# EasyEDA Pro project CapPiano.eprj

# Schematic Piano
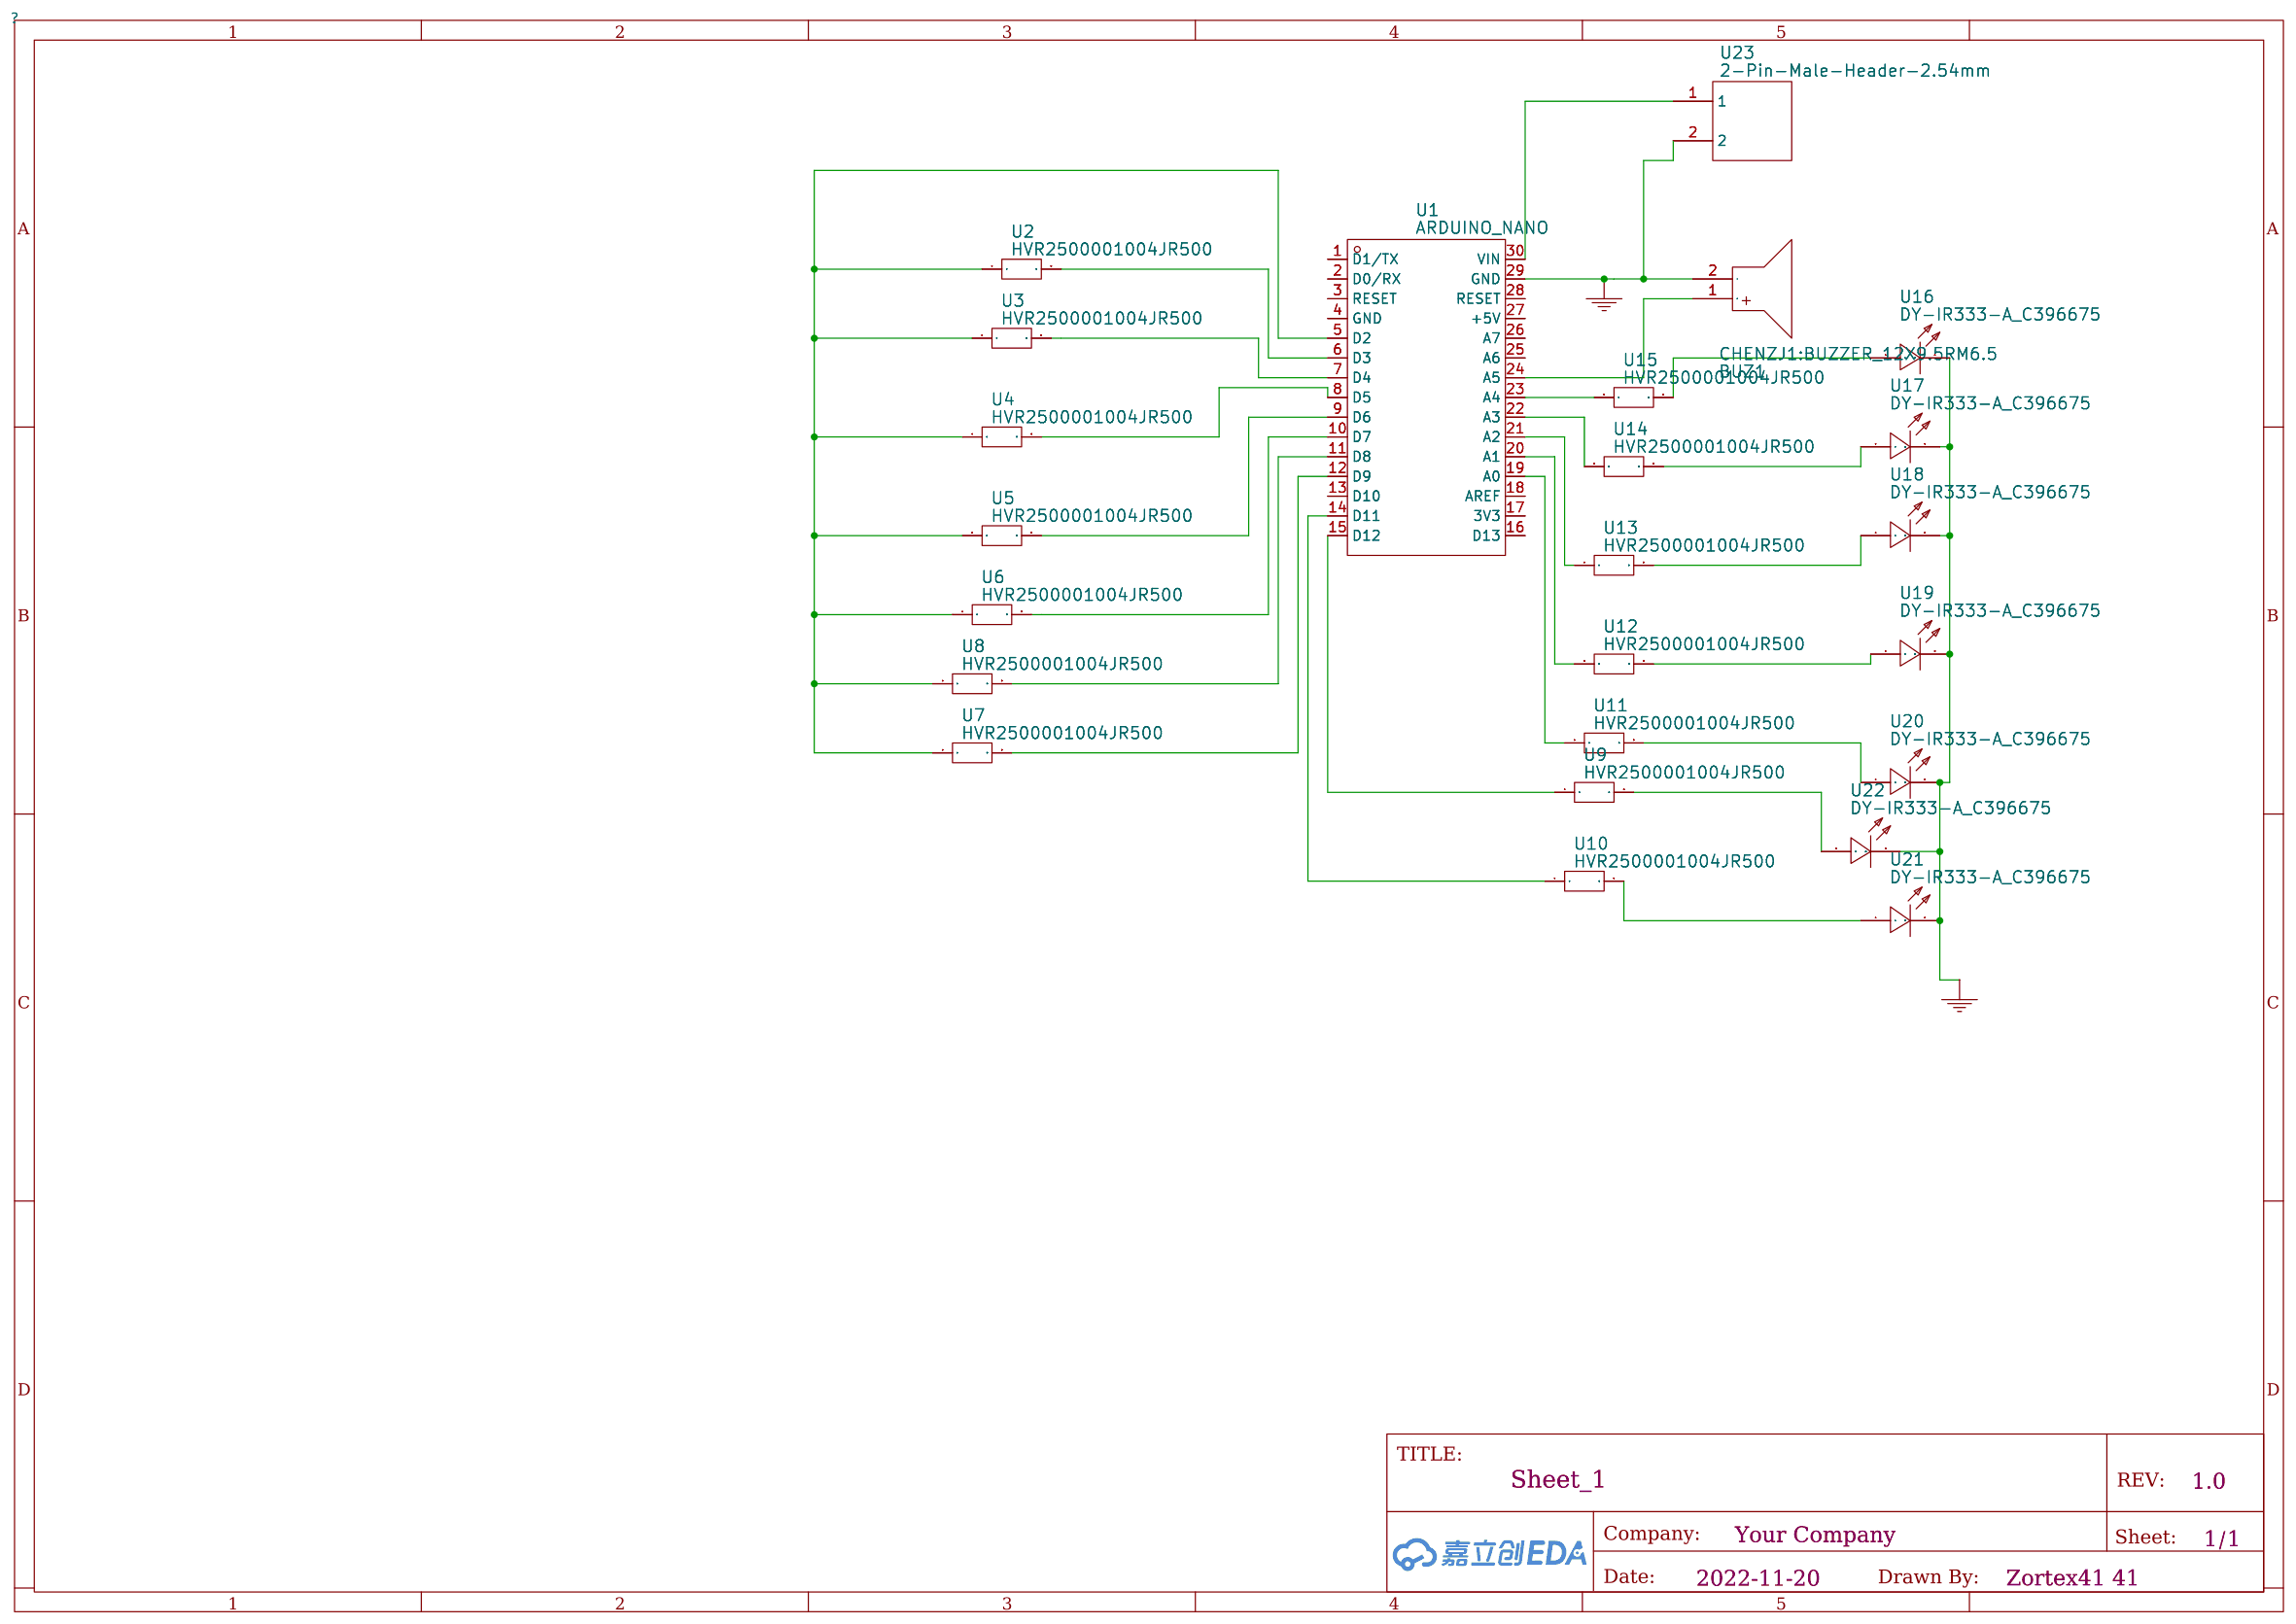
[diagram p0: schematic sheet]

## Parts
BUZ1  CHENZJ1:BUZZER_12X9.5RM6.5  [BUZ-TH_BD12.0-P6.50-D0.6_SEA-1285F]
U1  ARDUINO_NANO  [COMM-TH_ARDUINO_NANO]
U2  HVR2500001004JR500  [RES-TH_BD2.5-L7.0-P11.00-D0.6]
U3  HVR2500001004JR500  [RES-TH_BD2.5-L7.0-P11.00-D0.6]
U4  HVR2500001004JR500  [RES-TH_BD2.5-L7.0-P11.00-D0.6]
U5  HVR2500001004JR500  [RES-TH_BD2.5-L7.0-P11.00-D0.6]
U6  HVR2500001004JR500  [RES-TH_BD2.5-L7.0-P11.00-D0.6]
U7  HVR2500001004JR500  [RES-TH_BD2.5-L7.0-P11.00-D0.6]
U8  HVR2500001004JR500  [RES-TH_BD2.5-L7.0-P11.00-D0.6]
U9  HVR2500001004JR500  [RES-TH_BD2.5-L7.0-P11.00-D0.6]
U10  HVR2500001004JR500  [RES-TH_BD2.5-L7.0-P11.00-D0.6]
U11  HVR2500001004JR500  [RES-TH_BD2.5-L7.0-P11.00-D0.6]
U12  HVR2500001004JR500  [RES-TH_BD2.5-L7.0-P11.00-D0.6]
U13  HVR2500001004JR500  [RES-TH_BD2.5-L7.0-P11.00-D0.6]
U14  HVR2500001004JR500  [RES-TH_BD2.5-L7.0-P11.00-D0.6]
U15  HVR2500001004JR500  [RES-TH_BD2.5-L7.0-P11.00-D0.6]
U16  DY-IR333-A_C396675  [LED-TH_BD5.9-P2.54-FD]
U17  DY-IR333-A_C396675  [LED-TH_BD5.9-P2.54-FD]
U18  DY-IR333-A_C396675  [LED-TH_BD5.9-P2.54-FD]
U19  DY-IR333-A_C396675  [LED-TH_BD5.9-P2.54-FD]
U20  DY-IR333-A_C396675  [LED-TH_BD5.9-P2.54-FD]
U21  DY-IR333-A_C396675  [LED-TH_BD5.9-P2.54-FD]
U22  DY-IR333-A_C396675  [LED-TH_BD5.9-P2.54-FD]
U23  2-Pin-Male-Header-2.54mm  [2-PIN-MALE-HEADER-2.54MM]

## Library data of the parts
BUZ1 = CHENZJ1:BUZZER_12X9.5RM6.5: link: https://atta.szlcsc.com/upload/public/pdf/source/20211008/4CBF24C00656D781101954279FAE3DDF.pdf; Supplier: LCSC; Supplier Part: C9900008742; Manufacturer: null; Manufacturer Part: chenzj1:Buzzer_12x9.5RM6.5; JLCPCB Part Class: Extended Part
U1 = ARDUINO_NANO: link: https://cn.bing.com/search?q=datasheet%3A+%20ARDUINO_NANO; Supplier: LCSC; Supplier Part: C9900017879; Manufacturer: null; JLCPCB Part Class: Extended Part
U2-U15 = HVR2500001004JR500: link: https://atta.szlcsc.com/upload/public/pdf/source/20220512/3BF68C151D5667A1E9CA35E4E9B658B0.pdf; Supplier: LCSC; Supplier Part: C1741713; Manufacturer: VISHAY(威世)
U16-U22 = DY-IR333-A_C396675: link: https://item.szlcsc.com/378450.html; 3DModel: LED-TH_5mm_W; Supplier: LCSC; Supplier Part: C396675; Manufacturer: TONYU; Manufacturer Part: DY-IR333-A; JLCPCB Part Class: Extended Part
U23 = 2-Pin-Male-Header-2.54mm

## Nets
GND: BUZ1.2(-) U1.29(GND) U16.2(C) U17.2(C) U18.2(C) U19.2(C) U20.2(C) U21.2(C) U22.2(C) U23.2
U1_5: U1.5(D2) U2.1 U3.1 U4.1 U5.1 U6.1 U7.1 U8.1
U1_6: U1.6(D3) U2.2
U1_7: U1.7(D4) U3.2
U1_8: U1.8(D5) U4.2
U1_9: U1.9(D6) U5.2
U1_10: U1.10(D7) U6.2
U1_11: U1.11(D8) U8.2
U1_12: U1.12(D9) U7.2
U1_14: U1.14(D11) U10.1
U1_15: U1.15(D12) U9.1
U1_19: U1.19(A0) U11.1
U1_20: U1.20(A1) U12.1
U1_21: U1.21(A2) U13.1
U1_22: U1.22(A3) U14.1
U1_23: U1.23(A4) U15.1
U1_24: BUZ1.1(+) U1.24(A5)
U1_30: U1.30(VIN) U23.1
U9_2: U9.2 U22.1(A)
U10_2: U10.2 U21.1(A)
U11_2: U11.2 U20.1(A)
U12_2: U12.2 U19.1(A)
U13_2: U13.2 U18.1(A)
U14_2: U14.2 U17.1(A)
U15_2: U15.2 U16.1(A)

Not connected (* = marked no-connect by the designer): U1 1(D1/TX) 2(D0/RX) 3(RESET) 4(GND) 13(D10) 16(D13) 17(3V3) 18(AREF) 25(A6) 26(A7) 27(+5V) 28(RESET)

# Board 1-PCB_PCB_Piano
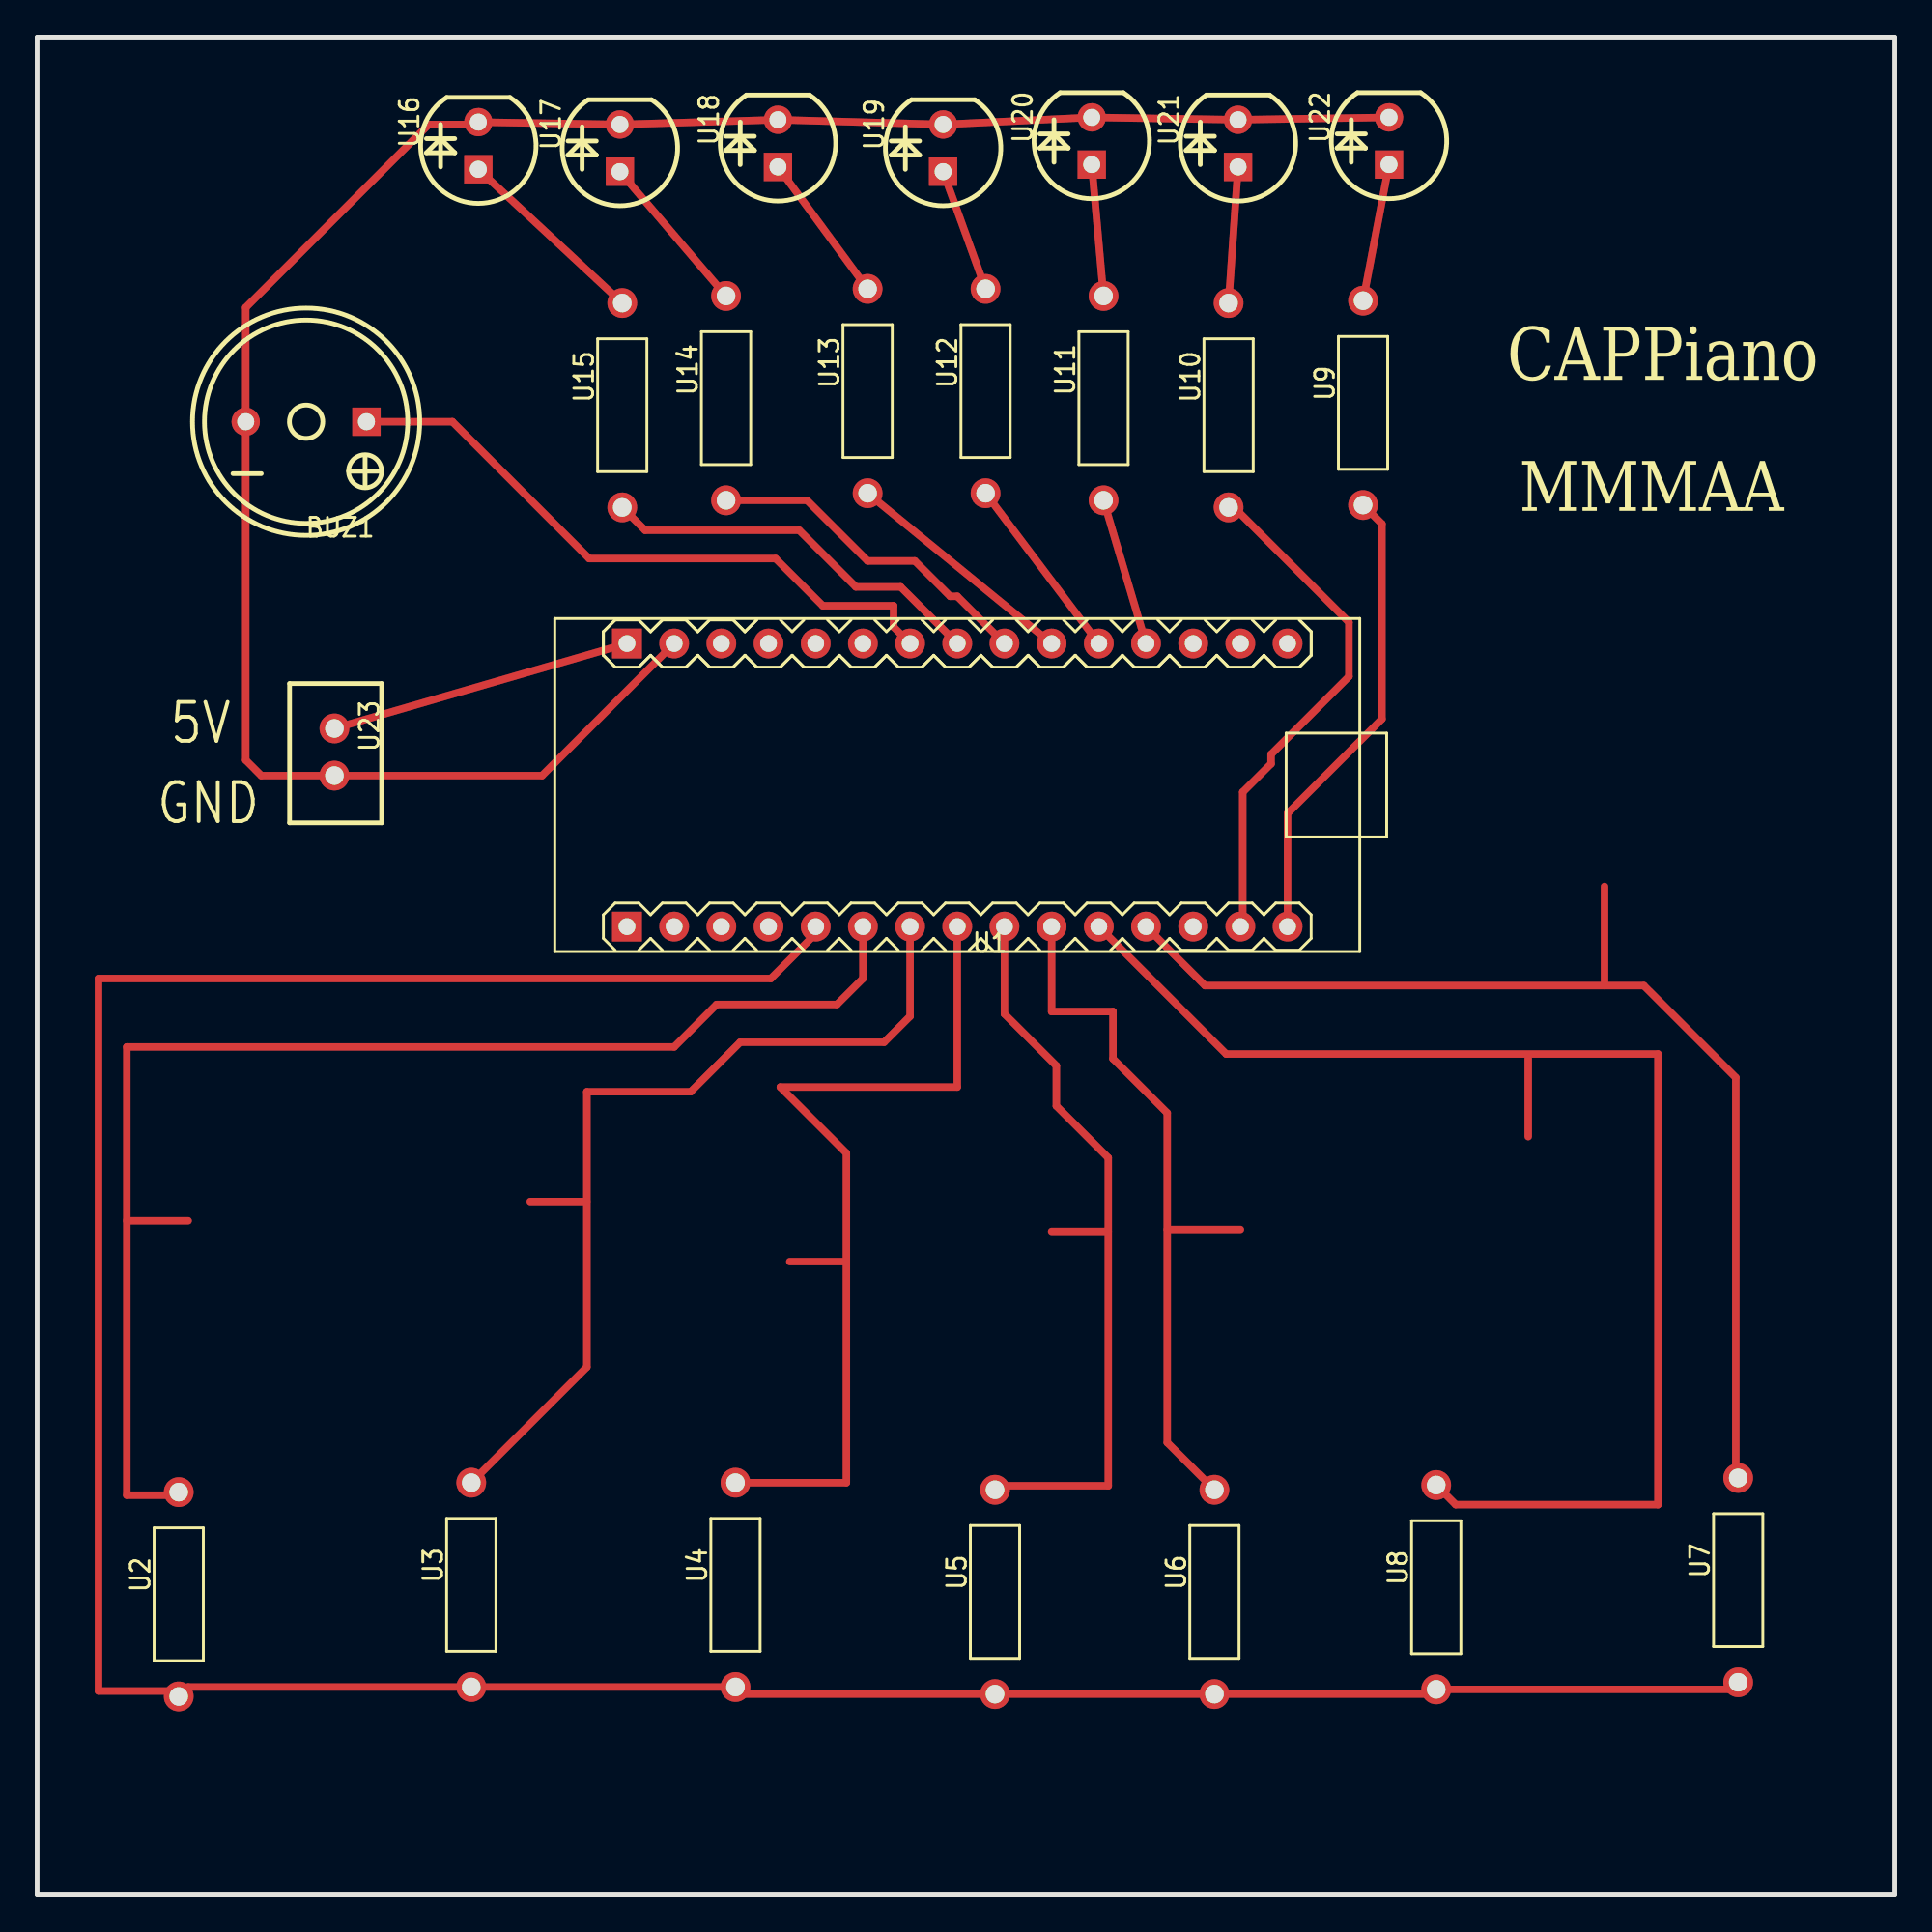
[diagram p1: board, top side]
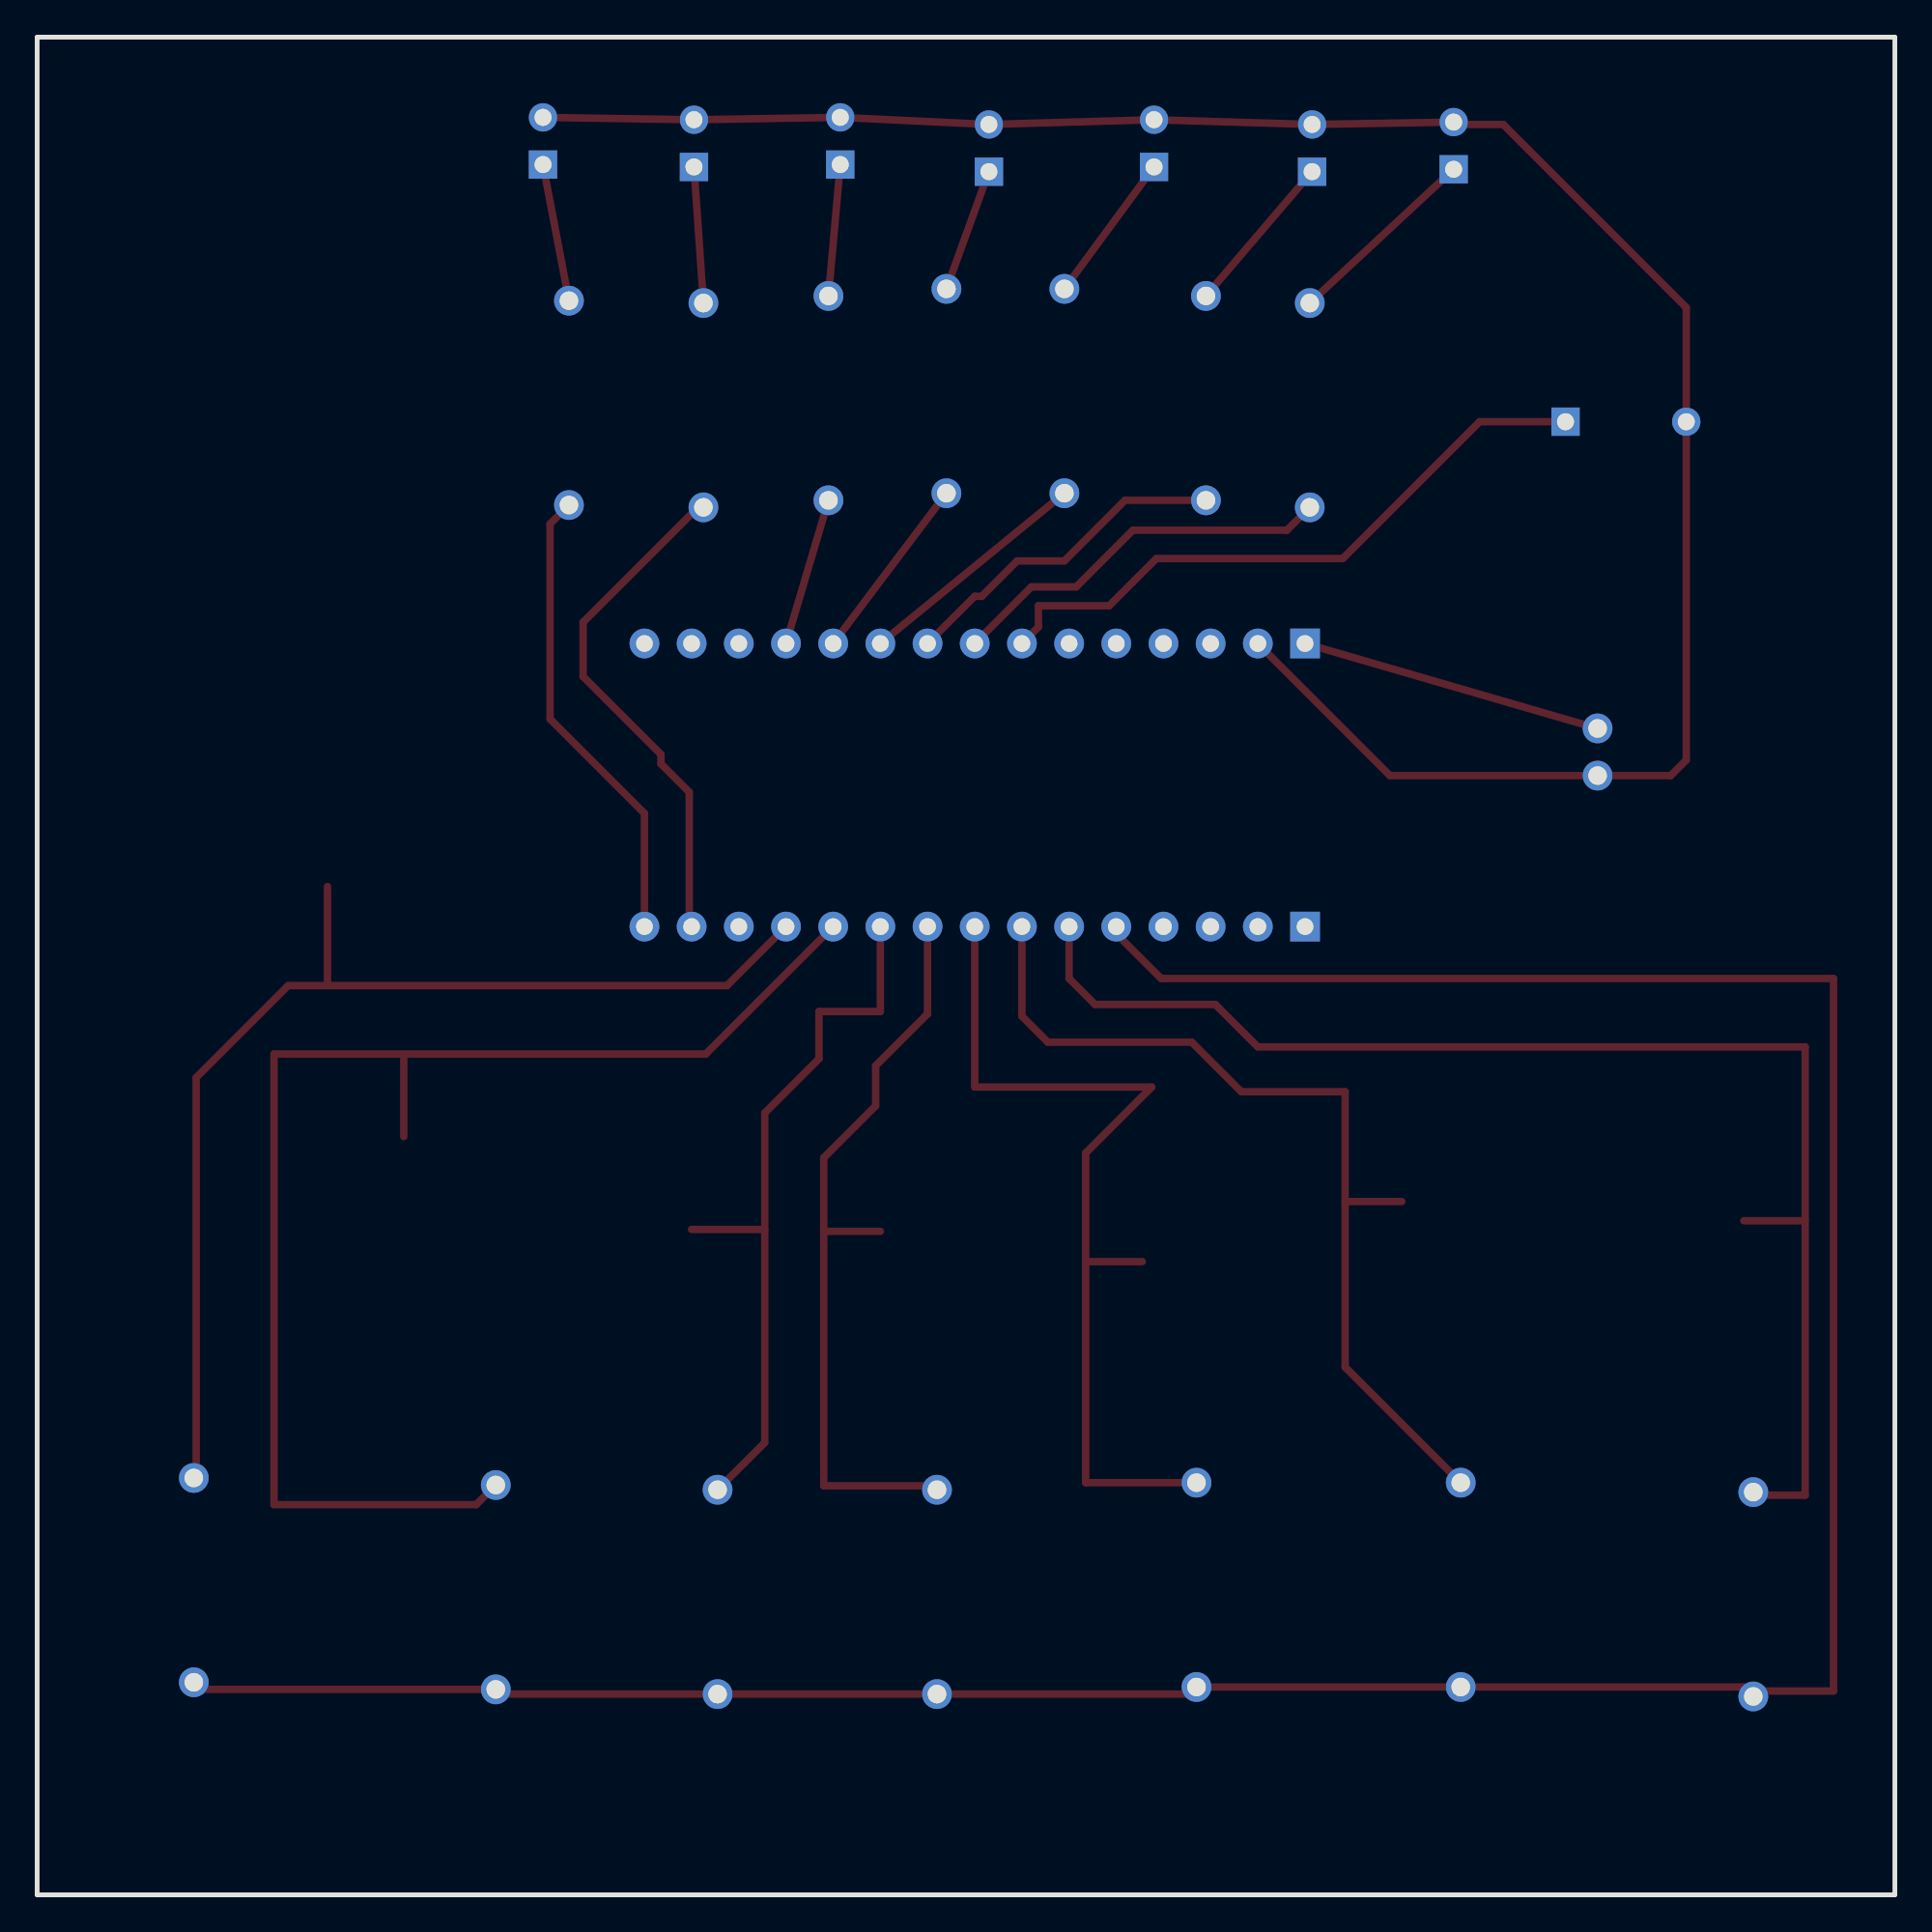
[diagram p2: board, bottom side, seen from below]

Outline 100 x 100 mm; copper layers: Top Layer, Bottom Layer. Coordinates in mm from the lower left corner of the outline.
Outline path: 0,100 100,100 100,0 0,0 0,100
Stack: Top Layer 0.035mm / Dielectric1 1.51mm FR4 er 4.5 / Bottom Layer 0.035mm

## Design rules (mm)
spacing Default (default): track to track 0.3, other pairs 0 to 0.3
track width Default (default): min 0.3, default 0.3, max 25.4
differential pair differentialPair (default): width min 0.127, default 0.254, max 2.54; gap min 0.152, default 0.152
via Default (default): diameter min 0.61, default 0.61, max 100.025; hole min 0.305, default 0.305, max 59.995
net U1_12 uses gge2850(1)
net U1_10 uses gge2850(2)
net U1_9 uses gge2850(3)
net U1_8 uses gge2850(4)
net U1_7 uses gge2850(5)
net U1_6 uses gge2850(6)
pour e124 uses gge2850(1)
pour e125 uses gge2850(2)
pour e126 uses gge2850(3)
pour e127 uses gge2850(4)
pour e128 uses gge2850(5)
pour e129 uses gge2850(6)

## Placement (name value [footprint] x y rotation side)
BUZ1  CHENZJ1:BUZZER_12X9.5RM6.5  [BUZ-TH_BD12.0-P6.50-D0.6_SEA-1285F]  14.48 79.3 180 top
U1  ARDUINO_NANO  [COMM-TH_ARDUINO_NANO]  49.53 59.74 180 top
U2  HVR2500001004JR500  [RES-TH_BD2.5-L7.0-P11.00-D0.6]  7.62 16.18 90 top
U3  HVR2500001004JR500  [RES-TH_BD2.5-L7.0-P11.00-D0.6]  23.37 16.69 90 top
U4  HVR2500001004JR500  [RES-TH_BD2.5-L7.0-P11.00-D0.6]  37.59 16.69 90 top
U5  HVR2500001004JR500  [RES-TH_BD2.5-L7.0-P11.00-D0.6]  51.56 16.31 90 top
U6  HVR2500001004JR500  [RES-TH_BD2.5-L7.0-P11.00-D0.6]  63.37 16.31 90 top
U7  HVR2500001004JR500  [RES-TH_BD2.5-L7.0-P11.00-D0.6]  91.57 16.94 90 top
U8  HVR2500001004JR500  [RES-TH_BD2.5-L7.0-P11.00-D0.6]  75.31 16.56 90 top
U9  HVR2500001004JR500  [RES-TH_BD2.5-L7.0-P11.00-D0.6]  71.37 80.31 90 top
U10  HVR2500001004JR500  [RES-TH_BD2.5-L7.0-P11.00-D0.6]  64.13 80.19 90 top
U11  HVR2500001004JR500  [RES-TH_BD2.5-L7.0-P11.00-D0.6]  57.4 80.57 90 top
U12  HVR2500001004JR500  [RES-TH_BD2.5-L7.0-P11.00-D0.6]  51.05 80.95 90 top
U13  HVR2500001004JR500  [RES-TH_BD2.5-L7.0-P11.00-D0.6]  44.7 80.95 90 top
U14  HVR2500001004JR500  [RES-TH_BD2.5-L7.0-P11.00-D0.6]  37.08 80.57 90 top
U15  HVR2500001004JR500  [RES-TH_BD2.5-L7.0-P11.00-D0.6]  31.5 80.19 90 top
U16  DY-IR333-A_C396675  [LED-TH_BD5.9-P2.54-FD]  23.75 94.16 90 top
U17  DY-IR333-A_C396675  [LED-TH_BD5.9-P2.54-FD]  31.37 94.03 90 top
U18  DY-IR333-A_C396675  [LED-TH_BD5.9-P2.54-FD]  39.88 94.28 90 top
U19  DY-IR333-A_C396675  [LED-TH_BD5.9-P2.54-FD]  48.77 94.03 90 top
U20  DY-IR333-A_C396675  [LED-TH_BD5.9-P2.54-FD]  56.77 94.41 90 top
U21  DY-IR333-A_C396675  [LED-TH_BD5.9-P2.54-FD]  64.64 94.28 90 top
U22  DY-IR333-A_C396675  [LED-TH_BD5.9-P2.54-FD]  72.77 94.41 90 top
U23  2-Pin-Male-Header-2.54mm  [2-PIN-MALE-HEADER-2.54MM]  16 62.79 270 top

## Footprints (pads in the part's own frame, mm; a bottom-side part is the same pattern mirrored in y, then rotated)
2-PIN-MALE-HEADER-2.54MM
  round 1.6 hole 1: 1(0,0) 2(2.54,0)
BUZ-TH_BD12.0-P6.50-D0.6_SEA-1285F
  rect 1.524x1.524 hole 0.914: 1(-3.25,0)
  round 1.524 hole 0.914: 2(3.25,0)
COMM-TH_ARDUINO_NANO
  rect 1.6x1.6 hole 0.9: 1(17.78,7.62) 30(17.78,-7.62)
  round 1.6 hole 0.9: 2(15.24,7.62) 3(12.7,7.62) 4(10.16,7.62) 5(7.62,7.62) 6(5.08,7.62) 7(2.54,7.62) 8(0,7.62) 9(-2.54,7.62) 10(-5.08,7.62) 11(-7.62,7.62) 12(-10.16,7.62) 13(-12.7,7.62) 14(-15.24,7.62) 15(-17.78,7.62) 16(-17.78,-7.62) 17(-15.24,-7.62) 18(-12.7,-7.62) 19(-10.16,-7.62) 20(-7.62,-7.62) 21(-5.08,-7.62) 22(-2.54,-7.62) 23(0,-7.62) 24(2.54,-7.62) 25(5.08,-7.62) 26(7.62,-7.62) 27(10.16,-7.62) 28(12.7,-7.62) 29(15.24,-7.62)
LED-TH_BD5.9-P2.54-FD
  rect 1.524x1.524 hole 0.914: 1(-1.27,0)
  round 1.524 hole 0.914: 2(1.27,0)
RES-TH_BD2.5-L7.0-P11.00-D0.6
  round 1.6 hole 1: 1(-5.5,0) 2(5.5,0)

## Nets
As in the schematic.

## Routing (per net, layer and track width the routed paths; a pad name or vN(x,y) marks a point on that pad's centre or on a via; arc(x,y) is an arc through that point)
GND: length 116.4
  Top Layer w0.4: U1.29 27.18,60.25 U23.2 12.06,60.25 11.23,61.09 BUZ1.2 11.23,85.45 21.08,95.3 23.62,95.3 U16.2 U17.2 39.88,95.56 U19.2 U20.2 64.64,95.56 U22.2
U1_5: length 167.4
  Top Layer w0.4: U7.1 91.19,11.06 U8.1 75.06,10.81 U6.1 U5.1 37.97,10.81 U4.1 U3.1 8.13,11.19 U2.1 7.33,10.97 3.3,10.97 3.3,49.33 39.5,49.33 41.91,51.74 U1.5
U1_6: length 74.2
  Top Layer w0.4: 4.83,36.29 8.13,36.29 ; U2.2 7.45,21.51 4.83,21.51 4.83,45.64 34.29,45.64 36.58,47.93 43.05,47.93 44.45,49.33 U1.6
U1_7: length 50.6
  Top Layer w0.4: 29.59,37.32 26.54,37.32 ; U3.2 29.59,28.41 29.59,43.23 35.18,43.23 37.85,45.9 45.59,45.9 46.99,47.3 U1.7
U1_8: length 49.9
  Top Layer w0.4: U1.8 49.53,43.48 40,43.48 43.56,39.93 43.56,22.19 U4.2 ; 43.56,34.09 40.51,34.09
U1_9: length 41.6
  Top Layer w0.4: U1.9 52.07,47.42 54.86,44.63 54.86,42.47 57.66,39.67 57.66,22.02 51.78,22.02 U5.2 ; 57.66,35.72 54.61,35.72
U1_10: length 39.8
  Top Layer w0.4: U1.10 54.61,47.55 57.91,47.55 57.91,45.01 60.83,42.09 60.83,24.35 U6.2 ; 60.83,35.82 64.77,35.82
U1_11: length 73.8
  Top Layer w0.4: U1.11 64.01,45.26 87.25,45.26 87.25,21.01 76.37,21.01 U8.2 ; 80.26,45.01 80.26,40.82
U1_12: length 62.1
  Top Layer w0.4: U1.12 62.87,48.95 86.49,48.95 91.44,43.99 91.44,22.57 U7.2 ; 84.37,48.95 84.37,54.28
U1_14: length 27.8
  Top Layer w0.4: U1.14 64.9,52.25 64.9,59.36 66.42,60.88 66.42,61.39 70.61,65.58 70.61,68.5 64.43,74.69 U10.1
U1_15: length 25.2
  Top Layer w0.4: U9.1 72.39,73.8 72.39,63.3 67.31,58.22 U1.15
U1_19: length 8
  Top Layer w0.4: U11.1 U1.19
U1_20: length 10.1
  Top Layer w0.4: U12.1 U1.20
U1_21: length 12.8
  Top Layer w0.4: U13.1 U1.21
U1_22: length 18.2
  Top Layer w0.4: U14.1 41.44,75.07 44.7,71.81 47.24,71.81 49.15,69.9 49.53,69.9 U1.22
U1_23: length 21.1
  Top Layer w0.4: U15.1 32.73,73.46 41.02,73.46 44.07,70.41 46.48,70.41 U1.23
U1_24: length 34.9
  Top Layer w0.4: U1.24 46.1,68.25 46.1,69.39 42.29,69.39 39.75,71.93 29.72,71.93 22.35,79.3 BUZ1.1
U1_30: length 16.4
  Top Layer w0.4: U23.1 U1.30
U9_2: length 7.5
  Top Layer w0.4: U22.1 U9.2
U10_2: length 7.3
  Top Layer w0.4: U21.1 U10.2
U11_2: length 7.1
  Top Layer w0.4: U20.1 U11.2
U12_2: length 6.7
  Top Layer w0.4: 48.77,92.76 U12.2
U13_2: length 8.1
  Top Layer w0.4: U18.1 U13.2
U14_2: length 8.8
  Top Layer w0.4: 31.37,92.76 U14.2
U15_2: length 10.6
  Top Layer w0.4: U16.1 U15.2

## Copper pours and planes (outline as drawn; the poured copper is in the pictures)
U1_6 on Top Layer: 16,42.34 16,27.61 6.61,27.61 6.86,42.47 15.88,42.47
U1_7 on Top Layer: 27.43,42.47 27.43,27.74 18.04,27.74 18.29,42.6 27.31,42.6
U1_8 on Top Layer: 41.53,39.55 41.53,24.82 32.13,24.82 32.38,39.67 41.4,39.67
U1_9 on Top Layer: 55.62,39.48 55.62,24.75 46.23,24.75 46.48,39.61 55.5,39.61
U1_10 on Top Layer: 72.77,42.15 72.77,27.42 63.37,27.42 63.63,42.28 72.64,42.28
U1_11 on Top Layer: 85.6,42.66 85.6,27.93 76.2,27.93 76.45,42.79 85.47,42.79
U1_12 on Top Layer: 88.77,67.3 88.77,52.57 79.38,52.57 79.63,67.42 88.65,67.42

## Text on the board
Top Silkscreen Layer: GND | 5V | MMMAA | CAPPiano
